# Altium schematic sheet Key&Led.SchDoc
size A4
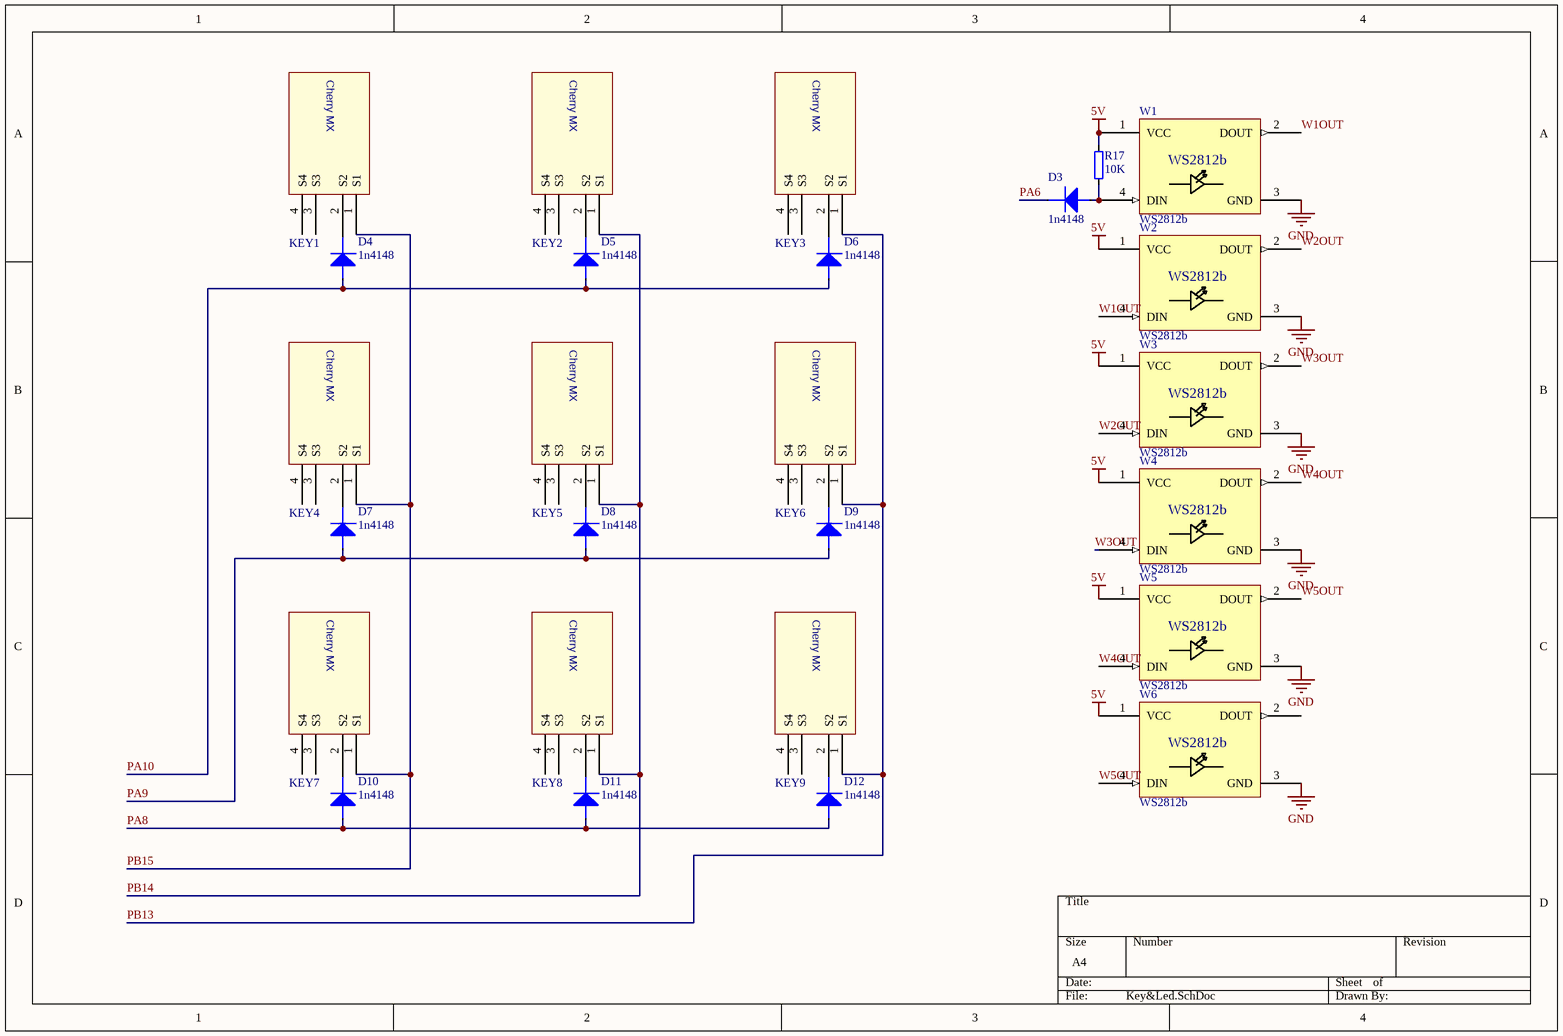
[diagram p0: Key&Led.SchDoc]

## Parts
D3  1n4148  [SOD-123]
D4  1n4148  [SOD-123]
D5  1n4148  [SOD-123]
D6  1n4148  [SOD-123]
D7  1n4148  [SOD-123]
D8  1n4148  [SOD-123]
D9  1n4148  [SOD-123]
D10  1n4148  [SOD-123]
D11  1n4148  [SOD-123]
D12  1n4148  [SOD-123]
KEY1  CHERRY_MX  [CHERRYMX]  (value not drawn)
KEY2  CHERRY_MX  [CHERRYMX]  (value not drawn)
KEY3  CHERRY_MX  [CHERRYMX]  (value not drawn)
KEY4  CHERRY_MX  [CHERRYMX]  (value not drawn)
KEY5  CHERRY_MX  [CHERRYMX]  (value not drawn)
KEY6  CHERRY_MX  [CHERRYMX]  (value not drawn)
KEY7  CHERRY_MX  [CHERRYMX]  (value not drawn)
KEY8  CHERRY_MX  [CHERRYMX]  (value not drawn)
KEY9  CHERRY_MX  [CHERRYMX]  (value not drawn)
R17  10K  [R 0603_L]
W1  WS2812b  [DIOC500500X250_NR]
W2  WS2812b  [DIOC500500X250_NR]
W3  WS2812b  [DIOC500500X250_NR]
W4  WS2812b  [DIOC500500X250_NR]
W5  WS2812b  [DIOC500500X250_NR]
W6  WS2812b  [DIOC500500X250_NR]

## Nets
5V: R17.1 W1.1(VCC) W2.1(VCC) W3.1(VCC) W4.1(VCC) W5.1(VCC) W6.1(VCC)
GND: W1.3(GND) W2.3(GND) W3.3(GND) W4.3(GND) W5.3(GND) W6.3(GND)
PA6: D3.2(K)
PA8: D10.1(A) D11.1(A) D12.1(A)
PA9: D7.1(A) D8.1(A) D9.1(A)
PA10: D4.1(A) D5.1(A) D6.1(A)
PB13: KEY3.1(S1) KEY6.1(S1) KEY9.1(S1)
PB14: KEY2.1(S1) KEY5.1(S1) KEY8.1(S1)
PB15: KEY1.1(S1) KEY4.1(S1) KEY7.1(S1)
W1OUT: W1.2(DOUT) W2.4(DIN)
W2OUT: W2.2(DOUT) W3.4(DIN)
W3OUT: W3.2(DOUT) W4.4(DIN)
W4OUT: W4.2(DOUT) W5.4(DIN)
W5OUT: W5.2(DOUT) W6.4(DIN)
NetD3_1: D3.1(A) R17.2 W1.4(DIN)
NetD4_2: D4.2(K) KEY1.2(S2)
NetD5_2: D5.2(K) KEY2.2(S2)
NetD6_2: D6.2(K) KEY3.2(S2)
NetD7_2: D7.2(K) KEY4.2(S2)
NetD8_2: D8.2(K) KEY5.2(S2)
NetD9_2: D9.2(K) KEY6.2(S2)
NetD10_2: D10.2(K) KEY7.2(S2)
NetD11_2: D11.2(K) KEY8.2(S2)
NetD12_2: D12.2(K) KEY9.2(S2)

Not connected (* = marked no-connect by the designer): KEY1 3(S3) 4(S4); KEY2 3(S3) 4(S4); KEY3 3(S3) 4(S4); KEY4 3(S3) 4(S4); KEY5 3(S3) 4(S4); KEY6 3(S3) 4(S4); KEY7 3(S3) 4(S4); KEY8 3(S3) 4(S4); KEY9 3(S3) 4(S4); W6 2(DOUT)

## Notes on the sheet
- (in symbol CHERRY_MX) Cherry MX

## Library data of the parts
D3-D12 = ZENER3: Zener Diode
R17 = RES
W1-W6 = WS2812b_Sumasta: The Infamous Chinese Chainable RGB LED